# EAGLE board HDMI-Display_v10-0603 (EAGLE 7.2.0)
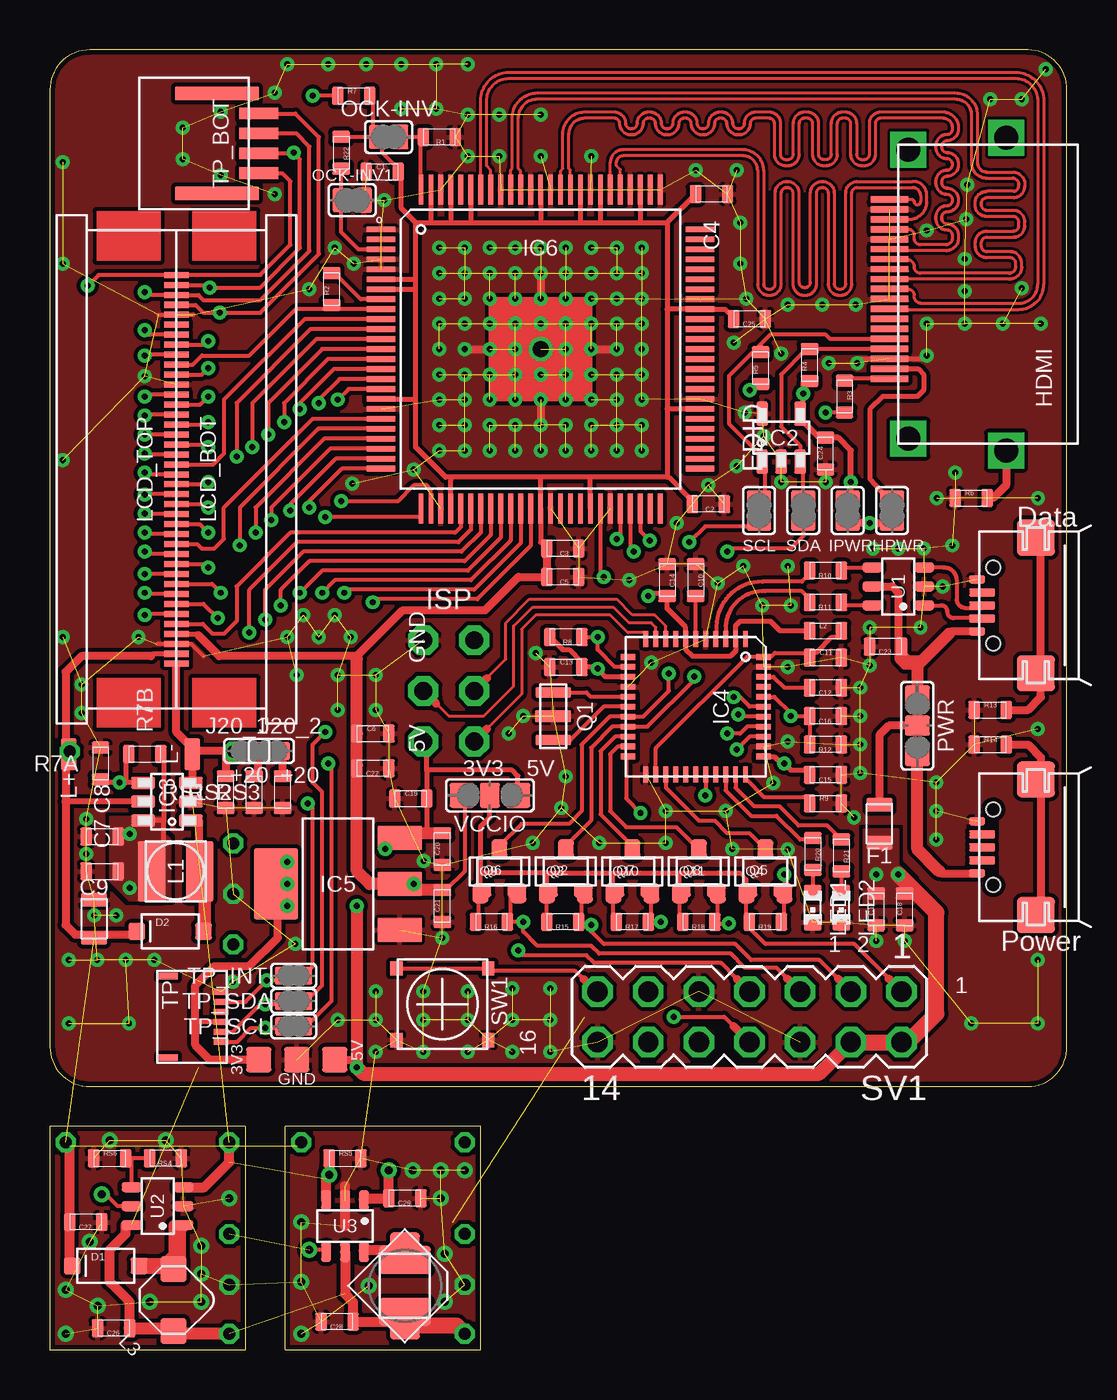
[diagram p2: board, top side]
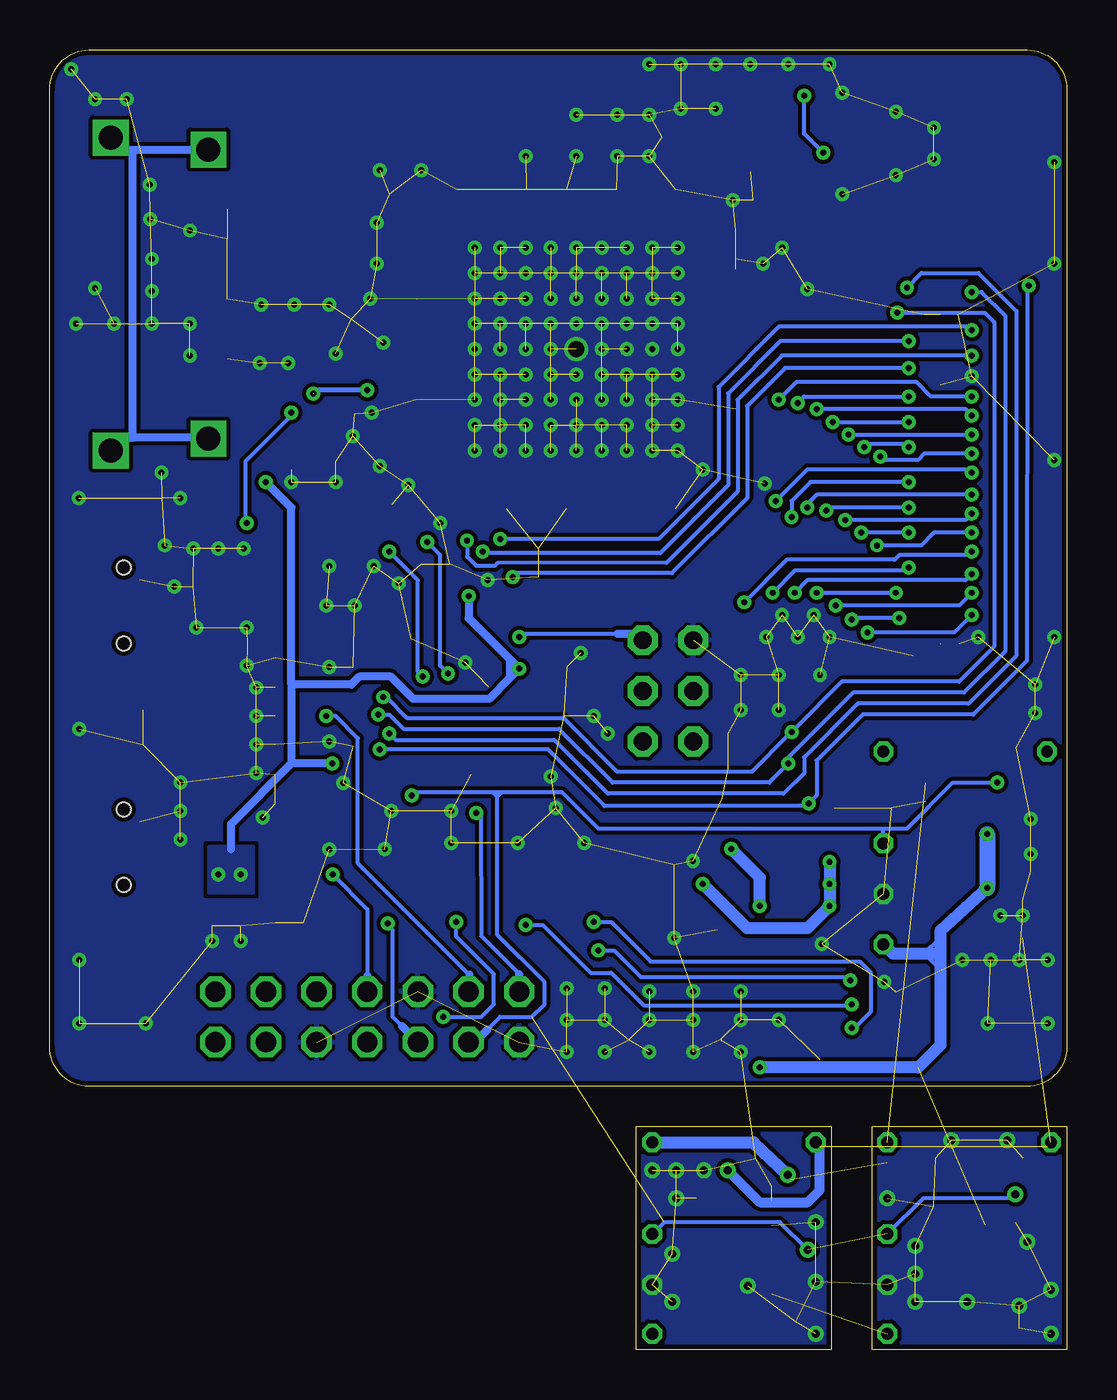
[diagram p3: board, bottom side, seen from below]

Size 51 x 65.2 mm. Coordinates in mm from the lower left corner, seen from the top.
Outline: 2,13.2 49.05,13.2 arc90 51,15.2 51,63.2 arc90 49.05,65.2 2,65.2 arc90 0,63.2 0,15.2 arc90 2,13.2
Outline: 0,0 9.8,0 9.8,11.2 0,11.2 0,0
Outline: 11.8,0 21.6,0 21.6,11.2 11.8,11.2 11.8,0
Copper layers (1+16): Top 0.018mm / dielectric 0.8mm / Bottom 0.018mm
Design rules "Rezonit-020-015": minimum track width 0.15mm, minimum drill 0.3mm, track to track 0.15mm, track to pad 0.2mm, pad to pad 0.2mm, via to via 0.2mm, smd to smd 0mil, copper to edge 0.25mm, drill to drill 0.3mm, minimum pad ring 0.2mm, minimum via ring 0.2mm, stop-mask expansion 4mil, vias tented up to drill 0.4mm, thermal gap 0.15mm

## Footprints (pad centres in the part's own frame; a part is rotated, then mirrored left to right if it is on the bottom)
PAD-1.27X1.27_NC = smd 1.27 x 1.27: 1 0,0
0603 = smd 0.6 x 0.9: 1 -0.8,0; 2 0.8,0
0805 = smd 0.7 x 1.3: 1 -0.95,0; 2 0.95,0
SOD-123 = smd 0.85 x 0.85: A 1.675,0; C -1.675,0
HDMI_10029449 = smd 1.9 x 0.3: 1 -0.95,4.75; 2 -0.95,4.25; 3 -0.95,3.75; 4 -0.95,3.25; 5 -0.95,2.75; 6 -0.95,2.25; 7 -0.95,1.75; 8 -0.95,1.25; 9 -0.95,0.75; 10 -0.95,0.25; 11 -0.95,-0.25; 12 -0.95,-0.75; 13 -0.95,-1.25; 14 -0.95,-1.75; 15 -0.95,-2.25; 16 -0.95,-2.75; 17 -0.95,-3.25; 18 -0.95,-3.75; 19 -0.95,-4.25 | drill 1.2 square: SHLD1 0,-7.25; SHLD2 4.9,-7.85; SHLD3 4.9,7.85; SHLD4 0,7.25
JUMPER2-0603 = smd 1.25 x 0.8: 1 0,0.6; 2 0,-0.6
SOT23-5 = smd 1.2 x 0.6: 1 -1.2,0.95; 2 -1.2,0; 3 -1.2,-0.95; 4 1.2,-0.95; 5 1.2,0.95
SOT23-6 = smd 1.2 x 0.6: 1 -1.2,0.95; 2 -1.2,0; 3 -1.2,-0.95; 4 1.2,-0.95; 5 1.2,0; 6 1.2,0.95
QFN44 = smd 0.8 x 0.3: 1 -3.4,2.5; 2 -3.4,2; 3 -3.4,1.5; 4 -3.4,1; 5 -3.4,0.5; 6 -3.4,0; 7 -3.4,-0.5; 8 -3.4,-1; 9 -3.4,-1.5; 10 -3.4,-2; 11 -3.4,-2.5; 23 3.4,-2.5; 24 3.4,-2; 25 3.4,-1.5; 26 3.4,-1; 27 3.4,-0.5; 28 3.4,0; 29 3.4,0.5; 30 3.4,1; 31 3.4,1.5; 32 3.4,2; 33 3.4,2.5 | smd 0.3 x 0.8: 12 -2.5,-3.4; 13 -2,-3.4; 14 -1.5,-3.4; 15 -1,-3.4; 16 -0.5,-3.4; 17 0,-3.4; 18 0.5,-3.4; 19 1,-3.4; 20 1.5,-3.4; 21 2,-3.4; 22 2.5,-3.4; 34 2.5,3.4; 35 2,3.4; 36 1.5,3.4; 37 1,3.4; 38 0.5,3.4; 39 0,3.4; 40 -0.5,3.4; 41 -1,3.4; 42 -1.5,3.4; 43 -2,3.4; 44 -2.5,3.4
SOT223 = smd 2.235 x 1.219: 1 -3.099,2.311; 2 -3.099,0; 3 -3.099,-2.311 | smd 2.2 x 3.6: 4 3.099,0
TQFP100-PAD = smd 1.5 x 0.3: 1 -8,6; 2 -8,5.5; 3 -8,5; 4 -8,4.5; 5 -8,4; 6 -8,3.5; 7 -8,3; 8 -8,2.5; 9 -8,2; 10 -8,1.5; 11 -8,1; 12 -8,0.5; 13 -8,0; 14 -8,-0.5; 15 -8,-1; 16 -8,-1.5; 17 -8,-2; 18 -8,-2.5; 19 -8,-3; 20 -8,-3.5; 21 -8,-4; 22 -8,-4.5; 23 -8,-5; 24 -8,-5.5; 25 -8,-6; 51 8,-6; 52 8,-5.5; 53 8,-5; 54 8,-4.5; 55 8,-4; 56 8,-3.5; 57 8,-3; 58 8,-2.5; 59 8,-2; 60 8,-1.5; 61 8,-1; 62 8,-0.5; 63 8,0; 64 8,0.5; 65 8,1; 66 8,1.5; 67 8,2; 68 8,2.5; 69 8,3; 70 8,3.5; 71 8,4; 72 8,4.5; 73 8,5; 74 8,5.5; 75 8,6 | smd 0.3 x 1.5: 26 -6,-8; 27 -5.5,-8; 28 -5,-8; 29 -4.5,-8; 30 -4,-8; 31 -3.5,-8; 32 -3,-8; 33 -2.5,-8; 34 -2,-8; 35 -1.5,-8; 36 -1,-8; 37 -0.5,-8; 38 0,-8; 39 0.5,-8; 40 1,-8; 41 1.5,-8; 42 2,-8; 43 2.5,-8; 44 3,-8; 45 3.5,-8; 46 4,-8; 47 4.5,-8; 48 5,-8; 49 5.5,-8; 50 6,-8; 76 6,8; 77 5.5,8; 78 5,8; 79 4.5,8; 80 4,8; 81 3.5,8; 82 3,8; 83 2.5,8; 84 2,8; 85 1.5,8; 86 1,8; 87 0.5,8; 88 0,8; 89 -0.5,8; 90 -1,8; 91 -1.5,8; 92 -2,8; 93 -2.5,8; 94 -3,8; 95 -3.5,8; 96 -4,8; 97 -4.5,8; 98 -5,8; 99 -5.5,8; 100 -6,8
ISP = drill 0.9 pad 1.5 octagon: GND 1.27,-2.54; MISO -1.27,2.54; MOSI 1.27,0; RST -1.27,-2.54; SCK -1.27,0; VCC 1.27,2.54
JUMPER2-0402 = smd 0.9 x 0.8: 1 0,0.55; 2 0,-0.55
L_1212 = smd 3 x 1.4: 1 0,1.2; 2 0,-1.2
CDRH2D18 = smd 1.3 x 1.3 rotated 45: 1 -1.1,1.1; 2 1.1,-1.1
CDRH3D16 = smd 1.5 x 1.4 rotated 45: 1 -1.4,1.4; 2 1.4,-1.4
LQH32CN_23/LQH32CN_33 = smd 1.4 x 2.6: 1 -1.3,0; 2 1.3,0
PAD-0.80X1.60_NC = smd 0.8 x 1.6: 1 0,0
FPC40 = smd 1.27 x 0.279: 1 0,9.75; 2 0,9.25; 3 0,8.75; 4 0,8.25; 5 0,7.75; 6 0,7.25; 7 0,6.75; 8 0,6.25; 9 0,5.75; 10 0,5.25; 11 0,4.75; 12 0,4.25; 13 0,3.75; 14 0,3.25; 15 0,2.75; 16 0,2.25; 17 0,1.75; 18 0,1.25; 19 0,0.75; 20 0,0.25; 21 0,-0.25; 22 0,-0.75; 23 0,-1.25; 24 0,-1.75; 25 0,-2.25; 26 0,-2.75; 27 0,-3.25; 28 0,-3.75; 29 0,-4.25; 30 0,-4.75; 31 0,-5.25; 32 0,-5.75; 33 0,-6.25; 34 0,-6.75; 35 0,-7.25; 36 0,-7.75; 37 0,-8.25; 38 0,-8.75; 39 0,-9.25; 40 0,-9.75
FPC40' = smd 1.27 x 0.279: 1 0.003,9.75; 2 0.003,9.25; 3 0.003,8.75; 4 0.003,8.25; 5 0.003,7.75; 6 0.003,7.25; 7 0.003,6.75; 8 0.003,6.25; 9 0.003,5.75; 10 0.003,5.25; 11 0.003,4.75; 12 0.003,4.25; 13 0.003,3.75; 14 0.003,3.25; 15 0.003,2.75; 16 0.003,2.25; 17 0.003,1.75; 18 0.003,1.25; 19 0.003,0.75; 20 0.003,0.25; 21 0.003,-0.25; 22 0.003,-0.75; 23 0.003,-1.25; 24 0.003,-1.75; 25 0.003,-2.25; 26 0.003,-2.75; 27 0.003,-3.25; 28 0.003,-3.75; 29 0.003,-4.25; 30 0.003,-4.75; 31 0.003,-5.25; 32 0.003,-5.75; 33 0.003,-6.25; 34 0.003,-6.75; 35 0.003,-7.25; 36 0.003,-7.75; 37 0.003,-8.25; 38 0.003,-8.75; 39 0.003,-9.25; 40 0.003,-9.75
LED_0603 = smd 0.9 x 0.8: A 0,-0.75; C 0,0.75
JUMPER2-0603_NC = smd 1.25 x 0.8: 1 0,0.6 | smd 1.2 x 0.8: 2 0,-0.6
JUMPER3-0603 = smd 1.25 x 1.25: 1 0,1.4; 3 0,-1.4 | smd 1.25 x 1: 2 0,0
CRYSTAL_32X13 = smd 1.8 x 0.5: 1 0,1.2; 2 0,-1.2 | smd 1.8 x 0.6: GND 0,0
SOT323 = smd 0.5 x 0.7: 1 -0.65,-0.95; 2 0.65,-0.95; 3 0,0.95
SOT-23 = smd 0.8 x 1: 1 -0.95,-1.1; 2 0.95,-1.1; 3 0,1.1
MA07-2 = drill 1.016 octagon: 1 -7.62,-1.27; 2 -7.62,1.27; 3 -5.08,-1.27; 4 -5.08,1.27; 5 -2.54,-1.27; 6 -2.54,1.27; 7 0,-1.27; 8 0,1.27; 9 2.54,-1.27; 10 2.54,1.27; 11 5.08,-1.27; 12 5.08,1.27; 13 7.62,-1.27; 14 7.62,1.27
SW_TL3315N = smd 0.65 x 0.7: 1 -2.3,1.8; 2 -2.3,-1.8; 3 2.3,-1.8; 4 2.3,1.8
FPC06 = smd 0.75 x 0.28: 1 0,1.25; 2 0,0.75; 3 0,0.25; 4 0,-0.25; 5 0,-0.75; 6 0,-1.25 | smd 1 x 0.3: SHLD1 2.65,2.04; SHLD2 2.65,-2.04
FPC04 = smd 2 x 0.6: 1 0,1.5; 2 0,0.5; 3 0,-0.5; 4 0,-1.5 | smd 4.2 x 0.7: SHLD1 2.1,2.5; SHLD2 2.1,-2.5
SOT23-6' = smd 1 x 0.5: 1 -1.3,0.95; 2 -1.3,0; 3 -1.3,-0.95; 4 1.3,-0.95; 5 1.3,0; 6 1.3,0.95
JUMPER3-0603_NC = smd 1.25 x 1.25: 1 0,1.4; 3 0,-1.4 | smd 1.25 x 1: 2 0,0
CU09SAM = smd 0.4 x 0.8: 1 1.3,-5.1; 5 -1.3,-5.1 | smd 0.4 x 1.3: 2 0.65,-4.85; 3 0,-4.85; 4 -0.65,-4.85 | smd 1.8 x 1.9: GND@1 -3.4,-2.15; GND@4 3.4,-2.15 | smd 1 x 1: GND@2 -3.2,-2.2; GND@3 3.2,-2.2 | hole 0.7: -1.9,-4.3; 1.9,-4.3

## Placement (x,y rotation side)
3V3  PAD-1.27X1.27_NC  [PAD-1.27X1.27_NC]  10.48,14.55 180 top
5V  PAD-1.27X1.27_NC  [PAD-1.27X1.27_NC]  14.29,14.55 180 top
C1  100n  [0603]  16.67,59.08 0 top
C2  100n  [0603]  33.02,42.41 180 top
C3  100n  [0603]  25.72,40.19 180 top
C4  100n  [0603]  33.18,57.97 180 top
C5  4u7  [0603]  25.72,38.76 180 top
C6  4u7  [0603]  16.2,30.9 0 top
C7  4u7  [0603]  2.62,23.99 0 top
C8  100n  [0603]  2.62,25.74 0 top
C9  1u @ 40V  [0805]  2.22,21.61 270 top
C10  1u  [0603]  32.38,38.6 270 top
C11  100n  [0603]  38.89,34.71 0 top
C12  100n  [0603]  38.89,33.2 180 top
C13  100n  [0603]  25.88,34.23 0 top
C14  100n  [0603]  30.96,38.6 270 top
C15  100n  [0603]  38.89,28.83 180 top
C16  tbd  [0603]  38.89,31.77 180 top
C17  100n  [0603]  41.43,22.09 90 top
C18  4u7  [0603]  42.86,22.09 90 top
C19  4u7  [0603]  18.1,27.65 0 top
C20  100n  [0603]  19.68,25.11 90 top
C21  100n  [0603]  19.68,22.25 90 top
C22  100n  [0603]  16.2,29.15 180 top
C23  100n  [0603]  41.91,35.27 180 top
C24  100n  [0603]  38.89,44.95 90 top
C25  100n  [0603]  35.08,51.7 180 top
C26  4u7  [0603]  3.2,1.08 180 top
C27  1u  [0603]  1.8,6.4 180 top
C28  4u7  [0603]  14.4,1.4 180 top
C29  1u  [0603]  17.8,7.6 180 top
D1  MBR120LSFT1G  [SOD-123]  2.8,4.2 0 top
D2  MBR120LSFT1G  [SOD-123]  6.03,20.98 0 top
F1  0.6A  [0805]  41.59,26.38 90 top
GND  PAD-1.27X1.27_NC  [PAD-1.27X1.27_NC]  12.38,14.55 180 top
HDMI  HDMI-A  [HDMI_10029449]  43.05,52.95 0 top
HPWR  JUMPER2-0603  [JUMPER2-0603]  42.23,42.09 0 top
IC2  24LC02B  [SOT23-5]  36.67,45.74 90 top
IC3  IS31BL3506A-TTLS2  [SOT23-6]  5.87,27.49 180 top
IC4  ATMEGA32U4-MU  [QFN44]  32.38,32.25 270 top
IC5  LDO-TS1117CW-3V3  [SOT223]  14.45,23.36 180 top
IC6  TFP401A-PAD  [TQFP100-PAD]  24.61,50.19 0 top
IPWR  JUMPER2-0603  [JUMPER2-0603]  40.01,42.09 180 top
ISP  ISP  [ISP]  20,33.04 180 top
J20_1  JUMPER2-0402  [JUMPER2-0402]  9.87,30.03 90 top
J20_2  JUMPER2-0402  [JUMPER2-0402]  11.11,30.03 90 top
L1  10u @ 500mA  [L_1212]  6.31,23.99 90 top
L2  FB600  [0603]  38.89,36.06 0 top
L3  CDRH2D18/LDNP-4R7NC  [CDRH2D18]  6.2,2.48 135 top
L4  CDRH3D16NP-220NC  [CDRH3D16]  17.8,3.2 315 top
L5  LQH32CN220K23  [LQH32CN_23/LQH32CN_33]  17.8,3.2 90 top
L+  PAD-0.80X1.60_NC  [PAD-0.80X1.60_NC]  0.95,29.87 0 top
L-  PAD-0.80X1.60_NC  [PAD-0.80X1.60_NC]  7.14,29.87 0 top
LCD_BOT  FPC40  [FPC40]  6.35,44.16 0 top
LCD_TOP  ER-TFT050-3  [FPC40']  6.35,44.16 180 top
LED1  green  [LED_0603]  38.26,22.17 180 top
LED2  red  [LED_0603]  39.69,22.17 180 top
OCK-INV  JUMPER2-0603-NC  [JUMPER2-0603_NC]  16.99,60.83 270 top
OCK-INV1  JUMPER2-0603-NC  [JUMPER2-0603_NC]  15.16,57.66 270 top
PWR  JUMPER3-0603  [JUMPER3-0603]  43.5,31.3 180 top
Q1  16MHz  [CRYSTAL_32X13]  25.24,31.77 0 top
Q2  [SOT323]  25.88,23.99 0 top
Q3  BSS138  [SOT-23]  25.88,23.99 0 top
Q4  BSS138  [SOT-23]  35.88,23.99 0 top
Q5  [SOT323]  35.88,23.99 0 top
Q6  [SOT323]  22.54,23.99 0 top
Q7  [SOT323]  29.21,23.99 0 top
Q8  [SOT323]  32.54,23.99 0 top
Q9  BSS138  [SOT-23]  22.54,23.99 0 top
Q10  BSS138  [SOT-23]  29.21,23.99 0 top
Q11  BSS138  [SOT-23]  32.54,23.99 0 top
R1  10K  [0603]  19.53,60.83 180 top
R2  1K  [0603]  14.13,53.2 90 top
R3  10K  [0603]  39.85,47.81 270 top
R4  4K7  [0603]  38.1,49.39 90 top
R5  4K7  [0603]  35.64,49.24 90 top
R6  0  [0603]  46.2,42.73 0 top
R7  NM  [0603]  15.24,62.89 0 top
R7A  100k  [0603]  2.54,29.4 270 top
R7B  NM  [0603]  4.76,29.87 0 top
R8  10k  [0603]  25.88,35.74 180 top
R9  10k  [0603]  38.89,27.4 0 top
R10  22  [0603]  38.89,39.08 180 top
R11  22  [0603]  38.89,37.49 180 top
R12  tbd  [0603]  38.89,30.34 180 top
R13  0  [0603]  47.15,32.09 0 top
R14  0  [0603]  47.15,30.34 0 top
R15  4k7  [0603]  25.72,21.45 180 top
R16  4k7  [0603]  22.15,21.45 180 top
R17  4k7  [0603]  29.21,21.45 180 top
R18  4k7  [0603]  32.54,21.45 180 top
R19  4k7  [0603]  35.88,21.45 180 top
R20  4k7  [0603]  38.26,24.86 270 top
R21  4k7  [0603]  39.69,24.78 270 top
R22  10K  [0603]  14.61,60.03 270 top
RS1  15  [0603]  8.81,27.96 90 top
RS2  15  [0603]  10.24,27.96 90 top
RS3  15  [0603]  11.67,27.96 90 top
RS4  1K5  [0603]  5.8,9.6 180 top
RS5  10  [0603]  14.8,9.6 0 top
RS6  DNP  [0603]  3,9.6 0 top
SCL  JUMPER2-0603  [JUMPER2-0603]  35.56,42.09 0 top
SDA  JUMPER2-0603  [JUMPER2-0603]  37.78,42.09 0 top
SV1  [MA07-2]  35.08,16.69 180 top
SW1  SW-TACTILE-TL3315  [SW_TL3315N]  19.68,17.33 0 top
TP  FPC06  [FPC06]  8.57,16.69 180 top
TP_BOT  FPC04  [FPC04]  10.48,60.51 180 top
TP_INT  JUMPER2-0402  [JUMPER2-0402]  12.22,18.76 270 top
TP_SCL  JUMPER2-0402  [JUMPER2-0402]  12.22,16.22 270 top
TP_SDA  JUMPER2-0402  [JUMPER2-0402]  12.22,17.49 270 top
U1  USBLC6-2SC6  [SOT23-6']  42.55,38.28 180 top
U2  LT1932  [SOT23-6']  5.4,7.2 180 top
U3  LT3465  [SOT23-6']  14.8,6.2 270 top
VCCIO  JUMPER3-0603-NC  [JUMPER3-0603_NC]  22.07,27.8 270 top
X5  USB-CU09SAM  [CU09SAM]  51.59,37.33 270 top
X6  USB-CU09SAM  [CU09SAM]  51.59,25.2 270 top

## Tracks (layer width: path | path; a pad name or v marks a point on that pad's centre or on a via)
+3V3  (via drill 0.3)
  Top 0.203: 19.11,56.59 19.05,56.54 | 21.11,56.55 21.11,56.54 | 29.61,56.62 29.53,56.54 | 27.61,56.63 27.61,56.54 | 26.61,56.6 26.67,56.54 | 31.02,52.19 30.96,52.19 | 31.05,47.19 30.96,47.19 | 27.11,43.72 27.15,43.76 | 20.11,43.62 20.16,43.76 | 18.33,53.69 18.34,53.68 | 18.32,53.19 18.34,53.29 | 18.3,47.69 18.34,47.65 | 20.11,56.59 20.16,56.54 | VCCIO.3 20.67,27.93 20.8,27.8 20.8,23.99 19.86,23.06 | C1.2 17.47,59.23 16.67,60.03 16.67,60.54 OCK-INV.2 | R22.1 OCK-INV.2 | R7.2 16.19,62.89 16.19,61.02 OCK-INV.2
  Top 0.254: 18.34,56.54 18.34,53.68 18.34,53.29 18.34,47.65 18.34,45.27 19.84,43.76 20.16,43.76 24.61,43.76 | 18.34,56.54 19.05,56.54 20.16,56.54 21.11,56.54 24.61,56.54 | 24.61,56.54 26.67,56.54 27.61,56.54 29.53,56.54 30.96,56.54 | 30.96,56.54 30.96,52.19 30.96,47.19 30.96,43.76 | 30.96,43.76 27.15,43.76 24.61,43.76 | IC6.99 19.11,56.59 | IC6.95 21.11,56.55 | IC6.78 29.61,56.62 | IC6.82 27.61,56.63 | IC6.84 26.61,56.6 | IC6.88 24.61,56.54 | 31.02,52.19 IC6.67 33.88,52.19 34.28,51.78 C25.2 | IC6.57 31.05,47.19 | IC6.43 27.11,43.72 | 24.61,43.76 IC6.38 24.61,40.5 C3.2 24.92,40.03 | IC6.29 20.11,43.62 | IC6.6 18.33,53.69 | IC6.7 18.32,53.19 | IC6.18 18.3,47.69 | IC6.97 20.11,56.59 | LCD_BOT.37 7.38,35.91 7.46,35.82 | 30.96,56.54 30.96,56.55 C4.2 | 30.96,43.76 31.03,43.76 32.22,42.58 C2.2 | 24.92,38.93 C5.2 | TP.3 7.39,16.44 7.3,16.53 | 11.27,23.28 IC5.4 v11.91,23.36 | 11.43,22.25 v11.91,22.25 | 18.34,56.54 17.62,57.26 17.62,59.08 C1.2 | C21.2 19.69,23.06 19.86,23.06 | C22.2 15.24,29.16 15.4,29.31 | C6.1
  Top 0.406: 7.46,35.82 8.49,34.79 15.24,34.79 | C5.2 23.5,38.76 21.83,37.09 17.7,37.09 15.4,34.79 15.24,34.79 | 24.92,38.93 C3.2 | 15.4,34.63 15.24,34.79 | 11.43,22.25 11.43,20.66 10.01,19.24 8.26,19.24 7.3,18.28 7.3,16.53 7.3,15.26 8.02,14.55 3V3.1
  Top 0.61: C21.2 17.55,23.05 IC5.2 | v18.26,23.36 IC5.2 | IC5.2 16.03,23.36 15.4,23.99 15.4,29.31 C6.1 15.4,34.63 | v11.91,24.47 v11.91,23.36 v11.91,22.25
  Bottom 0.61: v11.91,24.47 v11.91,22.25 13.02,21.14 16.03,21.14 v18.26,23.36
+5V  (via drill 0.3, 0.6)  (3 unrouted)
  Top 0.203: IC5.3 | 37.78,48.59 R4.1 | 5.58,29.61 5.56,29.62 R7B.2
  Top 0.254: 5.58,29.61 5.71,29.61 5.71,26.54 | 5.71,25.42 5.71,26.54 | 5.71,26.54 IC3.6 | IC4.34 36.31,29.75 36.67,29.39 v36.83,29.39 37.15,29.07 38.09,29.07 C15.2 | L2.1 36.6,36.06 36.12,36.54 34.61,36.54 34.38,36.31 IC4.2 34.38,35.04 34.13,34.79 32.23,34.79 31.89,35.13 IC4.7 31.89,36.24 30.96,37.17 C14.2 | C14.2 | VCCIO.1 23.47,28.79 23.18,29.07 18.89,29.07 | 18.89,29.07 18.89,30.34 ISP.VCC | IC4.14 27.87,33.75 v27.46,34.16 27.38,34.23 C13.2 26.68,34.47 26.04,35.11 25.72,35.11 R8.2 | v30,37.81 30.16,37.97 30.96,37.97 C14.2 | IC2.4 37.62,47.01 37.78,47.01 37.78,47.65 v37.78,47.97 37.78,48.59 | 18.89,29.07 C19.2 18.9,25.9 | C20.2 | R5.1 35.4,48.44 v35.08,48.12 | 38.91,45.74 C24.2
  Top 0.305: 38.91,45.74 39.53,45.74 40.16,45.11 v40.16,43.52 40.16,42.85 IPWR.2 | 37.62,47.01 37.62,46.7 38.57,45.75 C24.2
  Top 0.406: 5V.1 15.4,14.55
  Top 0.5: C26.1 4,2.4 3,3.4 3,5 3.8,5.8 3.8,6.25 U2.6 | U3.5 14.8,2.8 15.2,2.4 C28.1 17.8,1.4 | 17.8,1.4 L5.1 | 17.8,1.4 L4.2
  Top 0.6: v9,0.8 6.2,0.8 L3.1 6.2,1.08 C26.1
  Top 0.61: IC5.3 17.78,25.9 18.9,25.9 C20.2 19.79,25.9 | v15.4,22.25 15.4,14.55 v15.4,14.15 | SV1.4 | v16.83,25.11 17.3,25.58 17.46,25.58 IC5.3
  Top 0.7: v15.4,14.15 15.72,13.83 38.58,13.83 SV1.4
  Top 0.8: L4.2 20.38,1.22 v20.8,0.8
  Top 0.813: SV1.4 SV1.2 43.02,15.42 44.45,16.85 44.45,21.93 v42.55,23.84
  Bottom 0.203: 6.35,19.07 7.14,19.87 6.35,20.66
  Bottom 0.254: v35.08,48.12 37.54,48.12 37.7,47.97 v37.78,47.97
  Bottom 0.406: 38.89,33.36 35.88,33.36 35.48,33.76 33.9,33.76 32.78,32.65 28.97,32.65 27.94,33.68 | 38.89,33.36 38.89,29.39 | v36.83,29.39 38.89,29.39 | 27.94,33.68 v27.46,34.16 27.94,34.63 | 41.91,25.11 41.91,26.38 38.89,29.39 | v30,37.81 30,36.7 27.94,34.63 | 38.89,33.36 38.89,42.25 v40.16,43.52 | 27.94,34.63 27.94,33.68
  Bottom 0.61: v15.4,22.25 15.4,23.68 v16.83,25.11 | v4.01,23.16 6.35,21.02 6.35,20.66 6.35,19.87 | 6.35,19.87 6.35,19.07 6.35,15.26 7.46,14.15 v15.4,14.15 | v9.2,20.32 9.18,20.32 8.73,19.87 7.14,19.87 6.35,19.87
  Bottom 0.813: v4.01,25.86 v4.01,23.16
  other vias: 41.43,23.84
  pour Top (no thermals): 3.02,26.69 3.02,23.52 3.97,22.57 6.03,22.57 6.03,25.58 5.71,25.9 5.71,26.69
  pour Top (no thermals): 40.8,26.06 40.8,22.41 43.34,22.41 43.34,23.52 42.55,24.31 42.55,26.06
  pour Bottom: 40.8,22.88 43.02,22.88 43.02,25.27 40.8,25.27
AREF
  Top 0.203: IC4.42 36.28,33.75 36.83,33.2 C12.2
AVCC
  Top 0.203: IC4.24 30.39,30.17 34.96,34.75 IC4.44 36.16,34.75 36.35,34.95 38.1,34.95 | 38.1,34.95 38.16,34.95 | C11.1 38.1,34.64 38.1,34.95
  Top 0.254: 38.16,34.95 38.18,34.95 38.22,34.99 38.47,34.99 39.21,35.74 39.69,35.74 L2.2
B0
  Top 0.203: IC6.10 12.77,51.69 8.73,47.65 8.73,44.95 8.19,44.41 LCD_BOT.20
B1  (via drill 0.3)
  Top 0.203: IC6.11 13.06,51.19 9.37,47.49 v9.37,44.79 | v4.76,44.95 4.81,44.91 LCD_BOT.19
  Bottom 0.203: v4.76,44.95 7.14,44.95 7.46,44.63 9.21,44.63 v9.37,44.79
B2  (via drill 0.3)
  Top 0.203: IC6.12 13.36,50.69 10.16,47.49 v10.16,45.27 | v7.94,45.27 7.8,45.41 LCD_BOT.18
  Bottom 0.203: v7.94,45.27 8.1,45.43 10,45.43 v10.16,45.27
B3  (via drill 0.3)
  Top 0.203: IC6.13 13.65,50.19 10.95,47.49 v10.95,45.9 | v4.76,45.9 v4.77,45.91 LCD_BOT.17
  Bottom 0.203: v10.95,45.9 v4.76,45.9
B4  (via drill 0.3)
  Top 0.203: IC6.14 13.95,49.69 11.75,47.49 v11.75,46.54 | v7.94,46.54 7.81,46.41 LCD_BOT.16
  Bottom 0.203: v11.75,46.54 v7.94,46.54
B5  (via drill 0.3)
  Top 0.203: IC6.15 14.24,49.19 12.54,47.49 v12.54,47.17 | v4.76,46.86 4.81,46.91 LCD_BOT.15
  Bottom 0.203: v4.76,46.86 5.08,47.17 v12.54,47.17
B6  (via drill 0.3)
  Top 0.203: IC6.16 14.53,48.69 13.49,47.65 v13.49,47.49 | v7.94,47.81 7.54,47.41 LCD_BOT.14
  Bottom 0.203: v13.49,47.49 13.18,47.81 v7.94,47.81
B7  (via drill 0.3)
  Top 0.203: IC6.17 14.99,48.19 v14.45,47.65 | v4.76,47.81 4.86,47.91 LCD_BOT.13
  Bottom 0.203: v4.76,47.81 6.83,47.81 7.54,48.53 13.57,48.53 v14.45,47.65
CLK  (via drill 0.3)
  Top 0.203: v7.94,49.24 7.61,48.91 LCD_BOT.11 | IC6.44 27.61,38.93 v27.78,38.76
  Bottom 0.203: v7.94,49.24 14.13,49.24 16.04,47.33 16.04,42.73 19.81,38.96 27.58,38.96 v27.78,38.76 27.77,38.76
CLK_N
  Top 0.152: IC6.94 21.61,58.92 21.6,58.93 21.6,62.65 arc-90 23.02,64.07 48.42,64.07 arc-90 49.84,62.65 49.84,53.44 arc-90 48.58,52.18 42.16,52.18 HDMI.12
CLK_P
  Top 0.152: IC6.93 22.11,59.17 21.9,59.38 21.9,62.65 arc-90 23.02,63.77 48.42,63.77 arc-90 49.54,62.65 49.54,53.44 arc-90 48.58,52.48 43.66,52.48 arc-90 43.34,52.89 arc90 43.03,53.2 HDMI.10
D0_N
  Top 0.152: IC6.91 23.11,59.17 23.18,59.24 23.18,61.78 arc-90 24.45,63.04 45.4,63.04 arc-90 46.51,61.94 46.51,59.55 arc90 46.99,59.07 48.34,59.07 arc-90 48.89,58.36 arc-90 48.32,57.79 46.97,57.79 arc90 46.7,57.45 46.7,57.49 arc90 46.97,57.14 48.32,57.14 arc-90 48.89,56.57 48.89,56.38 arc-90 48.32,55.8 46.98,55.8 arc90 46.71,55.54 46.71,55.34 arc90 46.98,55.07 48.16,55.07 arc-90 48.73,54.5 48.73,54.32 arc-90 48.1,53.69 42.86,53.69 42.84,53.7 HDMI.9
D0_P
  Top 0.152: IC6.90 23.61,59.13 23.49,59.24 23.49,61.78 arc-90 24.45,62.74 45.4,62.74 arc-90 46.2,61.94 46.2,59.55 arc90 46.99,58.77 48.26,58.77 arc-90 48.58,58.44 arc-90 48.32,58.1 46.98,58.1 arc90 46.39,57.53 46.39,57.41 arc90 46.98,56.84 48.32,56.84 arc-90 48.58,56.57 48.58,56.38 arc-90 48.32,56.11 46.98,56.11 arc90 46.41,55.54 46.41,55.34 arc90 46.98,54.77 48.16,54.77 arc-90 48.42,54.5 48.42,54.32 arc-90 48.1,53.99 43.66,53.99 arc-90 43.34,54.32 arc90 42.95,54.7 HDMI.7
D1_N
  Top 0.152: IC6.86 25.61,59.13 25.72,59.24 25.72,60.98 arc-90 26.83,62.09 28.29,62.09 arc-90 28.86,61.52 arc90 29.13,61.25 29.19,61.25 arc90 29.46,61.52 arc-90 30.03,62.09 30.09,62.09 arc-90 30.66,61.52 arc90 30.92,61.25 30.98,61.25 arc90 31.25,61.52 arc-90 31.82,62.09 31.88,62.09 arc-90 32.45,61.52 arc90 32.71,61.25 32.77,61.25 arc90 33.04,61.52 arc-90 33.61,62.09 33.67,62.09 arc-90 34.24,61.52 arc90 34.51,61.25 34.56,61.25 arc90 34.83,61.52 arc-90 35.4,62.09 36.06,62.09 arc-90 36.63,61.52 36.63,59.97 arc90 36.9,59.7 37.01,59.7 arc90 37.28,59.97 37.28,61.52 arc-90 37.85,62.09 37.97,62.09 arc-90 38.54,61.52 38.54,59.97 arc90 38.81,59.7 38.92,59.7 arc90 39.19,59.97 39.19,61.52 arc-90 39.76,62.09 39.88,62.09 arc-90 40.45,61.52 40.45,59.97 arc90 40.72,59.7 40.83,59.7 arc90 41.1,59.97 41.1,61.52 arc-90 41.67,62.09 44.77,62.09 arc-90 45.55,61.3 45.55,61.21 arc-90 44.98,60.64 arc90 44.72,60.38 44.72,60.32 arc90 44.98,60.05 arc-90 45.55,59.48 45.55,59.42 arc-90 44.98,58.85 arc90 44.72,58.59 44.72,58.53 arc90 44.98,58.26 arc-90 45.55,57.69 45.55,57.64 arc-90 44.98,57.06 arc90 44.72,56.8 44.72,56.74 arc90 44.98,56.47 arc-90 45.55,55.9 45.55,55.75 arc-90 44.93,55.12 42.18,55.12 HDMI.6
D1_P
  Top 0.152: IC6.85 26.11,59.17 26.03,59.24 26.03,60.98 arc-90 26.83,61.78 28.29,61.78 arc-90 28.56,61.52 arc90 29.13,60.95 29.19,60.95 arc90 29.76,61.52 arc-90 30.03,61.78 30.09,61.78 arc-90 30.35,61.52 arc90 30.92,60.95 30.98,60.95 arc90 31.55,61.52 arc-90 31.82,61.78 31.88,61.78 arc-90 32.14,61.52 arc90 32.71,60.95 32.77,60.95 arc90 33.34,61.52 arc-90 33.61,61.78 33.67,61.78 arc-90 33.93,61.52 arc90 34.51,60.95 34.56,60.95 arc90 35.13,61.52 arc-90 35.4,61.78 36.06,61.78 arc-90 36.32,61.52 36.32,59.97 arc90 36.9,59.4 37.01,59.4 arc90 37.58,59.97 37.58,61.52 arc-90 37.85,61.78 37.97,61.78 arc-90 38.23,61.52 38.23,59.97 arc90 38.81,59.4 38.92,59.4 arc90 39.49,59.97 39.49,61.52 arc-90 39.76,61.78 39.88,61.78 arc-90 40.15,61.52 40.15,59.97 arc90 40.72,59.4 40.83,59.4 arc90 41.41,59.97 41.41,61.52 arc-90 41.67,61.78 44.77,61.78 arc-90 45.25,61.3 45.25,61.21 arc-90 44.98,60.95 arc90 44.41,60.38 44.41,60.32 arc90 44.98,59.75 arc-90 45.25,59.48 45.25,59.42 arc-90 44.98,59.16 arc90 44.41,58.59 44.41,58.53 arc90 44.98,57.96 arc-90 45.25,57.69 45.25,57.64 arc-90 44.98,57.37 arc90 44.41,56.8 44.41,56.74 arc90 44.98,56.17 arc-90 45.25,55.9 45.25,55.75 arc-90 44.93,55.42 43.66,55.42 arc-90 43.34,55.75 43.34,55.9 arc90 43.04,56.2 HDMI.4
D2_N
  Top 0.152: 28.11,59.09 28.11,59.08 | 28.11,59.08 28.11,59.55 arc-90 28.73,60.18 34.77,60.18 arc-90 35.79,59.16 35.79,53.46 arc90 36.06,53.19 36.1,53.19 arc90 36.37,53.46 36.37,58.03 arc-90 36.94,58.6 36.99,58.6 arc-90 37.56,58.03 37.56,53.55 arc90 37.83,53.28 37.87,53.28 arc90 38.14,53.55 38.14,58.03 arc-90 38.71,58.6 38.76,58.6 arc-90 39.33,58.03 39.33,53.46 arc90 39.6,53.19 39.64,53.19 arc90 39.91,53.46 39.91,58.03 arc-90 40.48,58.6 43.26,58.6 arc-90 43.97,57.97 43.97,57.81 arc-90 43.97,57.8 43.97,57.58 arc-90 43.09,56.7 HDMI.3 | IC6.81 28.11,59.08
D2_P
  Top 0.152: IC6.80 28.61,59.19 28.41,59.39 28.41,59.55 arc-90 28.73,59.88 34.77,59.88 arc-90 35.49,59.16 35.49,53.46 arc90 36.06,52.89 36.1,52.89 arc90 36.68,53.46 36.68,58.03 arc-90 36.94,58.29 36.99,58.29 arc-90 37.26,58.03 37.26,53.46 arc90 37.83,52.89 37.87,52.89 arc90 38.45,53.46 38.45,58.03 arc-90 38.71,58.29 38.76,58.29 arc-90 39.02,58.03 39.02,53.46 arc90 39.6,52.89 39.64,52.89 arc90 40.22,53.46 40.22,58.03 arc-90 40.48,58.29 43.26,58.29 arc-90 43.66,57.89 43.66,57.59 arc-90 43.5,57.42 arc-90 43.34,57.58 arc90 43.22,57.7 HDMI.1
D_N
  Top 0.203: 38.1,37.65 37.7,38.04 35.87,38.04 arc90 33.89,36.3 IC4.3 | 38.09,37.64 R11.2
  Top 0.254: 38.1,37.65 38.09,37.64
D_P
  Top 0.203: R10.2 38.09,38.91 37.7,38.52 35.73,38.52 arc90 33.42,36.3 33.42,35.69 IC4.4
DDC_SCL
  Top 0.203: 35.64,50.43 34.05,48.84 34.05,46.46 35.72,44.79 35.72,44.7 IC2.1 35.88,44.54 35.88,42.73 35.56,42.73 SCL.1 | 35.64,50.43 R5.2 | HDMI.15 39.12,50.7 38.92,50.9 36.12,50.9 35.64,50.43
DDC_SDA
  Top 0.152: 37.62,44.86 IC2.3
  Top 0.203: 37.62,44.86 37.62,45.35 36.67,46.3 36.67,48.92 37.86,50.11 37.94,50.11 R4.2 38.17,50.19 38.18,50.2 HDMI.16 | SDA.1 37.78,44.7 IC2.3
DE  (via drill 0.3)
  Top 0.2: LCD_BOT.7 5,50.91 v4.76,51.14
  Top 0.203: IC6.46 28.61,40.85 v28.42,40.66 | LCD_BOT.7
  Bottom 0.2: 14.44,51.31 17.46,48.28 17.46,43.68 20.48,40.66 v28.42,40.66
  Bottom 0.203: v4.76,51.14 4.87,51.26 4.92,51.31 14.44,51.31
G0
  Top 0.203: IC6.20 13.18,46.7 8.73,42.25 8.73,40.66 8.26,40.19 7.62,40.19 7.4,40.41 LCD_BOT.28
G1  (via drill 0.3)
  Top 0.203: IC6.21 13.46,46.19 9.53,42.25 v9.53,40.35 | v4.76,40.98 4.84,40.91 LCD_BOT.27
  Bottom 0.203: v4.76,40.98 6.67,40.98 7.3,40.35 v9.53,40.35
G2  (via drill 0.3)
  Top 0.203: IC6.22 13.76,45.69 10.32,42.25 v10.32,40.98 | v7.94,40.98 7.51,41.41 LCD_BOT.26
  Bottom 0.203: v7.94,40.98 v10.32,40.98
G3  (via drill 0.3)
  Top 0.203: IC6.23 14.05,45.19 11.11,42.25 v11.11,41.62 | v4.76,41.93 4.79,41.91 LCD_BOT.25
  Bottom 0.203: v4.76,41.93 5.08,41.62 v11.11,41.62
G4  (via drill 0.3)
  Top 0.203: IC6.24 14.34,44.69 12.06,42.41 v12.06,42.09 | v7.94,42.25 7.78,42.41 LCD_BOT.24
  Bottom 0.203: v7.94,42.25 11.91,42.25 v12.06,42.09
G5  (via drill 0.3)
  Top 0.203: IC6.25 14.64,44.19 13.02,42.57 v13.02,42.25 | v4.76,42.89 4.78,42.91 LCD_BOT.23
  Bottom 0.203: v4.76,42.89 12.54,42.89 13.02,42.41 v13.02,42.25
G6  (via drill 0.3)
  Top 0.203: v7.94,43.52 7.82,43.41 LCD_BOT.22 | IC6.26 18.61,41.81 18.57,41.77 v13.81,41.77
  Bottom 0.203: v7.94,43.52 12.86,43.52 13.81,42.57 v13.81,41.77
G7  (via drill 0.3)
  Top 0.203: v4.76,44 4.85,43.91 LCD_BOT.21 | v14.61,42.57 17.46,42.57 18.26,43.36 18.89,43.36 19.11,43.15 IC6.27
  Bottom 0.203: v4.76,44 4.92,44.16 13.02,44.16 v14.61,42.57
GND  (via drill 0.3, 0.4, 0.6, 0.8)  (355 unrouted)
  Top 0.203: 7.7,34.79 7.08,35.41 LCD_BOT.38 | 6.33,35.41 5.39,35.41 | 5.45,51.92 7.18,51.92
  Top 0.254: v40.48,49.47 40.48,49.71 43.81,49.71 v43.97,49.87
  Top 0.406: v20.8,50.19 v28.42,50.19 | 24.61,54.08 v24.61,46.38
  Top 0.5: 14.8,6.2 14.8,8.2
  other vias: 24.61,50.19 23.34,50.19 25.88,50.19 27.15,50.19 28.42,51.46 27.15,51.46 25.88,51.46 24.61,51.46 23.34,51.46 22.07,51.46 20.8,51.46 22.07,50.19 20.8,52.73 20.8,54 22.07,54 23.34,54 24.61,54 19.53,54 19.53,52.73 19.53,51.46 19.53,50.19 29.69,50.19 29.69,51.46 28.42,52.73 29.69,52.73 25.88,52.73 27.15,52.73 24.61,52.73 23.34,52.73 22.07,52.73 20.8,55.27 22.07,55.27 23.34,55.27 24.61,55.27 19.53,55.27 25.88,54 27.15,54 28.42,54 29.69,54 25.88,55.27 27.15,55.27 28.42,55.27 29.69,55.27 25.88,46.38 27.15,46.38 28.42,46.38 29.69,46.38 20.8,47.65 20.8,48.92 22.07,48.92 23.34,48.92 24.61,48.92 19.53,48.92 19.53,47.65 28.42,47.65 29.69,47.65 25.88,47.65 27.15,47.65 24.61,47.65 23.34,47.65 22.07,47.65 25.88,48.92 27.15,48.92 28.42,48.92 29.69,48.92 20.8,45.11 20.8,46.38 22.07,46.38 23.34,46.38 19.53,46.38 19.53,45.11 28.42,45.11 29.69,45.11 25.88,45.11 27.15,45.11 24.61,45.11 23.34,45.11 22.07,45.11 18.26,44.16 15.16,43.44 2.22,21.77 1.83,24.87 1.59,31.93 4.45,35.74 19.68,20.66 27.15,59.87 24.61,59.87 22.54,59.87 34.45,59.16 32.38,59.16 43.97,51.46 40.4,52.41 20.95,61.94 20.95,64.48 45.88,51.46 47.78,51.46 49.69,51.46 38.73,52.41 36.99,52.41 34.92,52.73 34.61,54.47 34.61,56.54 49.93,64.24 45.24,40.35 43.81,40.19 44.45,27.01 44.45,25.58 30.16,34.47 36.99,30.5 41.27,40.19 41.12,36.22 35.72,37.33 33.5,38.44 36.99,39.31 37.15,37.33 34.77,39.31 43.66,36.22 42.55,40.19 36.99,34.23 49.53,31.14 49.53,19.55 49.55,42.73 34.21,25.11 41.12,34.31 24.37,34.95 0.64,59.55 0.64,54.47 0.64,35.74 16.76,57.66 11.27,63.05 15.08,35.74 34.45,44.31 44.47,42.73 0.95,19.55 0.64,44.63 30.88,27.01 29.05,38.6 48.74,62.73 47.15,62.73 22.54,61.94 24.61,61.94 20.95,59.87 4.76,48.84 45.88,54.71 48.74,53.24 15.24,54.47 46,58.44 45.96,56.7 20.95,14.95 12.38,33.84 16.35,33.84 18.75,24.52 25.64,27.17 36.28,28.43 31.43,41.46 14.45,33.84 45.4,44 39.05,49.47 16.35,32.09 14.45,32.09 13.49,35.74 11.91,35.74 12.7,36.85 14.29,36.85 23.73,31.77 25.87,28.76 1.59,33.36 12.3,20.34 14.45,16.53 11.27,57.97 44.76,38.28 44.45,28.44 40.64,28.92 40.64,30.34 40.64,31.77 40.64,33.2 25.08,16.53 23.18,16.53 46.2,16.38 49.53,16.38 0.95,16.38 3.97,16.38 35.8,45.83 36.99,25.1 40.32,26.69 41.43,20.5 42.86,20.5 30.88,25.42 27.54,25.42 24.21,25.42 33.89,27.01 23.02,30.9 45.88,53.1 43.97,56.14 2.38,19.55 3.81,19.55 5.24,19.55 3.33,21.77 1.83,26.61 13.02,53.2 34.85,47.01 36.67,49.95 33.02,43.36 19.37,62.25 17.62,62.25 17.62,64.48 19.37,64.48 15.88,64.48 13.97,64.48 11.91,64.48 8.57,62.09 6.67,61.3 8.57,58.92 6.67,59.71 9.2,22.86 25.08,18.11 23.18,18.11 23.18,14.95 25.08,14.95 16.35,16.53 20.95,16.53 18.73,16.53 18.73,14.95 16.35,14.95 18.73,17.96 16.35,17.96 20.95,17.96 36.67,43.52 34.29,50.51 14.29,55.27 20.8,3.26 9,3.26 12.6,6.4 19.6,7.6 19.6,9 20.8,9 16,3.2 12.6,0.8 12.6,3.4 18.2,9 0.8,3 0.8,0.8 2.4,2.2 5,2.4 7.6,2.4 7.6,5.2 7.6,3.8 19.8,4.8 19.8,2.4 9,7.6 5.8,10.5 3,10.5 2,5.4 9.17,18.45 38.9,43.52
  pour Bottom (isolate 0.2, rank 2): 0,13.2 51.05,13.2 51.05,65.2 0,65.2
  pour Top (isolate 0.2, rank 2): 0,13.2 51.02,13.2 51.02,51.83 43.34,51.83 43.34,57.78 40.61,57.78 40.61,52.33 34.92,52.33 34.92,59.18 20.55,59.18 20.55,65.21 0,65.2
  pour Top (isolate 0.15): 20.55,65.21 20.55,58.52 34.92,58.52 34.92,52.33 40.64,52.33 40.64,57.73 43.34,57.73 43.34,51.86 43.42,51.83 51.04,51.83 51.04,65.21
  pour Top (isolate 0.2): 12,11 21.4,11 21.4,0.2 12,0.2
  pour Top (isolate 0.2): 0.2,0.2 0.2,11 9.6,11 9.6,0.2
  pour Bottom (isolate 0.2): 0.2,0.2 0.2,11 9.6,11 9.6,0.2
  pour Bottom (isolate 0.2): 12,11 21.4,11 21.4,0.2 12,0.2
GPIO
  Top 0.203: IC4.25 30.89,28.19 32.54,26.54 33.34,26.54 33.97,25.9 35.08,25.9 35.88,25.11 Q4.3 Q5.3
HDMI_5V
  Top 0.254: HPWR.1 41.94,42.76 41.12,43.68 41.12,47.17 41.75,47.81 43.5,47.81 43.81,48.12 43.81,48.92 43.53,49.2 HDMI.18
HDMI_DECT
  Top 0.203: HDMI.19 39.93,48.7 39.84,48.61 R3.1
HSYNC  (via drill 0.3)
  Top 0.203: v4.76,49.87 4.8,49.91 LCD_BOT.9 | IC6.48 29.61,41.06 v30.08,40.58
  Bottom 0.203: v4.76,49.87 14.29,49.87 16.51,47.65 16.51,43.05 20.08,39.48 28.56,39.45 28.7,39.31 29.61,39.31 30.08,39.79 v30.08,40.58
HWB
  Top 0.203: IC4.33 34.88,28.64 35.8,27.72 38.09,27.72 38.09,27.71 R9.1
LED1
  Top 0.203: IC4.31 33.88,28.05 35.16,26.78 36.43,26.78 37.62,25.58 38.42,25.58 R20.1
LED2
  Top 0.203: IC4.32 34.38,28.19 35.32,27.25 36.59,27.25 37.55,26.29 38.98,26.29 39.53,25.74 R21.1
LED+  (via drill 0.4, 0.6)  (2 unrouted)
  Top 0.203: LCD_BOT.39 | 4.1,20.82 4.36,20.82 D2.C | L+.1 0.95,29.95 v1,30
  Top 0.254: LCD_BOT.39 5.2,34.91 5.08,34.79 | 2.22,20.82 C9.2
  Top 0.305: IC3.5 0.79,27.49
  Top 0.406: 0.79,29.87 0.79,34 1.59,34.79 5.08,34.79 | L+.1 0.79,29.87 | 0.79,29.87 0.79,27.49 0.79,21.3 1.27,20.82 2.22,20.82 | C9.2 2.22,20.82 4.1,20.82
  Top 0.5: D1.C 1.12,4.27 1,4.2 C27.2 1,10.2 v0.8,10.4 | U3.1 15.75,7.6 C29.2 v17,9
  Bottom 0.5: v17,9 15.4,7.4 13,7.4 12.4,8 12.4,10.2 v12.6,10.4
LED-  (via drill 0.4, 0.6)  (2 unrouted)
  Top 0.203: LCD_BOT.40 | 7.2,29.93 L-.1 | v9.2,30 9.3,30 J20_1.1
  Top 0.254: LCD_BOT.40 6.35,34.31
  Top 0.406: 7.14,30.03 7.14,30.19 6.35,30.98 6.35,34.31 | 7.14,30.03 J20_1.1 8.75,30.04 8.83,30.04 8.83,28.84 8.81,28.84 RS1.2 | IC3.3 7.14,28.51 L-.1 7.14,30.03
  Top 0.5: U2.3 7.75,8.15 9,9.4 v9,10.4 | U3.3 13.85,8.55 v14,8.77 RS5.1
  Bottom 0.6: v20.8,10.4 15.72,10.4 v14,8.77
LIGHT  (via drill 0.3)
  Top 0.203: IC4.40 36.33,32.75 37.15,31.93 v37.15,31.77 C16.2 R12.2
  Bottom 0.203: v37.15,31.77 36.67,31.77 35.56,30.66 35.56,24.39 29.97,18.8
  Bottom 0.254: 29.97,17.99 29.98,17.99 SV1.11
  Bottom 0.406: 29.97,18.8 29.97,17.99
LV_GPIO  (via drill 0.3)
  Top 0.203: v36.82,23.83 v36.83,23.84 Q4.2 | Q4.2 36.83,21.61 R19.1 | TP.5 9.8,17.44 v10.88,18.52 11.59,18.52 11.67,18.52 TP_INT.2 | 34.45,18.6 33.66,19.39 27.3,19.39 26.91,19.79 23.73,19.79 v23.5,20.03 | Q5.2 36.68,23.05 Q4.2
  Top 0.254: 35.07,17.98 SV1.7
  Top 0.406: 35.07,17.98 34.45,18.6
  Bottom 0.203: v36.82,23.83 35.08,22.09 35.08,18.76 | v23.5,20.03 22.7,20.03 21.35,18.68 11.04,18.68 v10.88,18.52
  Bottom 0.254: 35.08,17.99 SV1.7
  Bottom 0.406: 35.08,18.76 35.08,17.99
LV_RXD  (via drill 0.3)
  Top 0.203: R17.1 30.16,21.61 Q10.2 30.01,23.05 Q7.2 | R17.1 v30.63,21.46 | 30.01,21.38 R17.1 | v31.27,16.69 33.81,16.69 34.29,16.22
  Top 0.254: 30.01,21.38 R17.1
  Top 0.406: 34.29,16.22 SV1.8
  Bottom 0.203: v31.27,16.69 29.37,16.69 28.73,17.33 28.73,18.84 30.63,20.74 v30.63,21.46
LV_SCL  (via drill 0.3)
  Top 0.203: 36.97,18.61 36.44,19.15 34.85,19.15 34.13,19.87 27.54,19.87 27.14,20.26 24.45,20.26 23.73,20.98 v23.73,21.45 23.11,21.45 23.1,21.38 R16.1 | 11.65,16.24 TP_SCL.2 11.64,16.17 11.64,16.14 v10.79,16.14 | 10.78,16.24 v10.79,16.14 | TP.1 9.39,15.44 10.08,16.14 v10.79,16.14 | 23.1,21.46 23.1,21.47 23.1,22.88 Q9.2 23.34,23.05 Q6.2
  Top 0.254: 23.1,21.46 R16.1
  Top 0.406: 36.97,18.61 SV1.5
  Bottom 0.203: v23.73,21.45 22.86,21.45 20.88,19.47 10.4,19.47 9.84,18.91 9.84,16.93 10.64,16.14 v10.79,16.14
LV_SDA  (via drill 0.3)
  Top 0.203: 26.45,21.55 26.67,21.61 26.67,22.89 Q3.2 26.68,23.05 Q2.2 | 39.51,18.61 38.58,19.55 35.16,19.55 34.37,20.34 27.77,20.34 27.14,20.98 v27.14,21.3 26.53,21.3 | TP.2 9.17,15.94 10.56,17.33 v10.79,17.33 11.59,17.33 11.67,17.41 TP_SDA.2
  Top 0.254: 26.45,21.55 R15.1 26.52,21.38 26.53,21.3
  Top 0.406: 39.51,18.61 SV1.3
  Bottom 0.203: v27.14,21.3 26.28,21.3 23.89,18.91 22.85,18.91 21.19,17.25 10.87,17.25 v10.79,17.33
LV_TXD  (via drill 0.3)
  Top 0.203: 33.34,21.38 v34.05,21.38 | 33.34,21.54 33.5,21.69 Q11.2 33.34,23.05 Q8.2
  Top 0.254: R18.1 33.34,21.53 33.34,21.54 R18.1 | R18.1 33.34,21.38
  Bottom 0.203: v34.05,21.38 33.81,21.06 33.81,16.69 33.34,16.22
  Bottom 0.406: SV1.10 33.34,16.22
LX
  Top 0.203: 7.78,24.08 L1.2
  Top 0.254: D2.A 7.75,20.98 7.78,21.01 | 7.78,23.2 7.5,23.49 L1.2
  Top 0.406: IC3.1 7.46,26.54 7.46,24.95 7.78,24.63 7.78,24.08
  Top 0.635: 7.78,23.2 7.78,21.01
MISO
  Top 0.152: IC4.11 29.89,35.97 28.98,35.97 28.1,36.85 24.37,36.85 23.65,36.14 23.65,32.88 21.91,31.14
  Top 0.406: 21.91,31.14 ISP.MISO
MOSI
  Top 0.152: 19.37,32.41 20,31.77 21.75,31.77 23.26,33.28 23.26,36.3 24.21,37.25 28.26,37.25 29.05,36.46 30.16,36.46 30.39,36.23 IC4.10
  Top 0.406: ISP.MOSI 19.37,32.41
N$1
  Top 0.406: J20_2.2 11.66,28.75 RS3.2
N$3
  Top 0.203: U1.6 39.69,37.33 R11.1
N$4
  Top 0.406: J20_2.1 J20_1.2 10.42,28.78 RS2.2
N$5
  Top 0.152: U1.4
  Top 0.203: R10.1 39.69,39.23 U1.4
N$6
  Top 0.203: IC6.100 18.61,60.83 | R1.2 18.61,60.83 | 18.61,60.83 OCK-INV.1
N$7
  Top 0.203: IC6.3 15.48,55.19 14.61,56.06 14.61,57.37 OCK-INV1.2 14.61,57.49 R22.2
N$8
  Top 0.203: IC4.6 C10.2
N$9  (via drill 0.3)
  Top 0.203: R3.2 39.69,47.01 v38.89,47.01 | 42.1,41.46 HPWR.2 | 40.13,41.46 IPWR.1
  Top 0.406: 42.1,41.46 v41.12,41.46 40.13,41.46
  Bottom 0.203: v38.89,47.01 38.89,46.86 41.2,44.55 41.19,41.43 41.19,41.46 v41.12,41.46
N$10
  Top 0.2: RS4.2 4.1,9.6 | 4.1,9.6 RS6.2 | U2.4 4.1,9.6
N$11
  Top 0.406: PWR.2 42.07,31.3 41.59,30.82 F1.2
N$14
  Top 0.254: 6.6,6.2 6.7,6.2 U2.1
  Top 0.5: 6.2,4.2 5.6,4.2 6.2,4.8 | L3.2 6.2,4.2 | 6.2,4.2 6.2,4.8 | 6.2,4.8 6.2,5.6 | 6.2,5.6 6.2,6.25 U2.1 | 6.2,5.6 6.8,6.2 | 6.6,4.2 6.6,6.2
  Top 0.8: D1.A 5.6,4.2
N$16
  Top 0.5: U3.6 15.75,5 17.8,5 | L5.2 17.8,5 | 17.8,5 L4.1
N$17
  Top 0.203: R20.2 LED1.A
N$18
  Top 0.203: R21.2 LED2.A
PDO
  Top 0.203: 14.19,52.19 14.13,52.25 R2.1 | IC6.9 14.19,52.19 | R2.1 | R2.1 | LCD_BOT.10 7.16,49.41 7.62,49.87 10,49.87 12.32,52.19 14.19,52.19
PWM  (via drill 0.3, 0.4, 0.6)  (2 unrouted)
  Top 0.2: U2.5 3.4,7.2 2.8,7.8 v2.6,7.8 | U3.4 13.85,4.95 13.8,5 v13,5
  Top 0.203: 4.6,28.51 IC3.4 4.76,28.44 | IC4.29 32.88,27.83 v32.86,27.8
  Top 0.254: 4.6,28.51 4.6,28.44 3.81,28.44 | R7A.2 2.54,28.44 v3.49,28.44 3.81,28.44 | R7B.1 3.81,29.87 3.81,28.44
  Bottom 0.2: v2.6,7.8 2.8,7.6 7.2,7.6 v9,5.8 | v13,5 14.4,6.4 20.2,6.4 v20.8,5.8
  Bottom 0.203: 29.05,16.06 28.42,16.69 26.83,16.69 26.19,17.33 26.19,18.44 28.56,20.81 28.56,27.73 | v32.86,27.8 32.7,27.96 28.56,27.96 | 28.56,27.96 25.32,27.96 23.5,26.14 9.2,26.14 | 9.2,26.14 8.02,26.14 5.71,28.44 v3.49,28.44 | v9.2,25.4 9.2,26.14 | 28.56,27.73 28.56,27.96 | 28.56,27.73 28.73,27.89 | 28.56,27.73 28.4,27.89
  Bottom 0.406: 29.05,16.06 29.69,15.42 SV1.12
R0
  Top 0.203: IC6.30 20.61,41.27 20.32,40.98 12.06,40.98 9.37,38.28 9.37,36.54 8.73,35.9 8.18,35.9 7.67,36.41 LCD_BOT.36
R1  (via drill 0.3)
  Top 0.203: IC6.31 21.11,41.13 20.48,40.5 12.38,40.5 10,38.12 v10,35.98 | v4.76,36.85 4.82,36.91 LCD_BOT.35
  Bottom 0.203: v4.76,36.85 5.64,35.98 v10,35.98
R2  (via drill 0.3)
  Top 0.203: IC6.32 21.61,41 20.64,40.03 12.7,40.03 10.79,38.12 v10.79,36.61 | v8.41,36.7 7.7,37.41 LCD_BOT.34
  Bottom 0.203: v8.41,36.7 10.76,36.7 10.81,36.64 v10.79,36.61
R3  (via drill 0.3)
  Top 0.203: IC6.33 22.11,40.86 20.8,39.55 13.02,39.55 11.59,38.12 v11.59,37.33 | v4.76,37.97 4.82,37.91 LCD_BOT.33
  Bottom 0.203: v4.76,37.97 5.4,37.33 v11.59,37.33
R4  (via drill 0.3)
  Top 0.203: IC6.34 22.61,40.73 20.95,39.08 13.65,39.08 v12.54,37.97 | v8.57,37.97 8.13,38.41 LCD_BOT.32
  Bottom 0.203: v8.57,37.97 v12.54,37.97
R5  (via drill 0.3)
  Top 0.203: IC6.35 23.11,40.59 21.11,38.6 14.29,38.6 v13.65,37.97 | v4.76,38.92 4.77,38.91 LCD_BOT.31
  Bottom 0.203: v4.76,38.92 5.08,38.6 13.02,38.6 v13.65,37.97
R6  (via drill 0.3)
  Top 0.203: IC6.36 23.61,40.46 21.27,38.12 14.92,38.12 v14.76,37.97 | v7.94,39.23 7.77,39.41 LCD_BOT.30
  Bottom 0.203: v7.94,39.23 8.01,39.2 8.14,39.07 13.66,39.07 v14.76,37.97
R7  (via drill 0.3)
  Top 0.203: v4.76,40.03 4.88,39.91 LCD_BOT.29 | IC6.37 24.11,40.32 21.43,37.65 16.35,37.65 v16.19,37.49
  Bottom 0.203: v4.76,40.03 4.92,39.87 8.4,39.87 8.64,39.63 14.05,39.63 v16.19,37.49
RST  (via drill 0.3)
  Top 0.203: IC4.13 28.32,34.25 27.46,35.11 v27.46,35.74 R8.1
  Bottom 0.203: 22.54,35.9 27.3,35.9 v27.46,35.74
  Bottom 0.406: ISP.RST 21.59,35.9 22.54,35.9
RXD
  Top 0.203: IC4.20 28.34,30.75 27.62,30.03 27.62,26.85 29.21,25.27 Q10.3 Q7.3
SCDT
  Top 0.203: IC6.8 15.6,52.69 14.27,54.01 14.26,54 R2.2
SCK
  Top 0.152: 21.91,33.68 22.86,34.63 22.86,36.46 24.05,37.65 28.42,37.65 29.21,36.85 30.32,36.85 30.89,36.29 IC4.9
  Top 0.406: ISP.SCK 21.91,33.68
SCL  (via drill 0.3)
  Top 0.203: v31.04,33.92 31.04,33.04 29.74,31.75 IC4.18 28.07,31.75 26.67,30.34 26.67,27.01 26.04,26.38 23.65,26.38 22.54,25.27 Q9.3 Q6.3 | SCL.2 35.56,41.14 35.4,41.3 32.86,41.3 v32.07,40.5
  Bottom 0.203: v31.04,33.92 31.43,34.31 31.43,39.87 v32.07,40.5
SDA  (via drill 0.3)
  Top 0.203: v32.31,33.76 32.31,33.6 29.96,31.25 IC4.19 28.21,31.25 27.15,30.19 27.15,26.54 25.88,25.27 Q3.3 Q2.3 | SDA.2 37.78,40.82 37.15,40.19 34.13,40.19 v33.97,40.03
  Bottom 0.203: v32.31,33.76 32.54,34 32.54,38.6 v33.97,40.03
SHLD1
  Top 0.406: R13.2 49.05,32.09 49.69,32.73 49.69,33.84 | 49.69,33.84 49.69,40.51 X5.GND@2 49.71,40.68 X5.GND@1 | X5.GND@3 49.76,34.08 X5.GND@4 49.76,33.91 49.69,33.84
SHLD2
  Top 0.406: R14.2 49.05,30.34 49.69,29.71 49.69,28.6 | 49.69,28.6 49.69,22.14 X6.GND@3 49.6,21.95 X6.GND@4 | X6.GND@2 49.55,28.55 X6.GND@1 49.69,28.6
SHLD3
  Top 0.406: HDMI.SHLD2 47.95,43.37 47.31,42.73 R6.2
  Bottom 0.406: 46.83,45.74 43.05,45.74 HDMI.SHLD1 | 46.83,45.74 47.95,45.74 HDMI.SHLD2 | 46.83,45.74 46.83,60.19 | 46.83,60.19 47.95,60.19 HDMI.SHLD3 | 46.83,60.19 HDMI.SHLD4
SW1  (via drill 0.3)
  Top 0.203: SW1.1 SW1.4 22.09,19.23 22.09,19.1 22.07,19.07 22.12,19.06 22.12,18.99 26.35,18.99 26.75,18.6 | IC4.22 28.93,29.75 28.89,29.71 28.89,27.65 v29.62,26.93
  Top 0.254: 27.45,17.98 SV1.13
  Top 0.406: 27.45,17.98 27.41,17.98 27.41,17.99 26.75,18.6
  Bottom 0.203: v29.62,26.93 29.53,26.88 29.39,26.74 29.37,20.74 27.46,18.84
  Bottom 0.254: 27.46,17.99 SV1.13
  Bottom 0.406: 27.46,18.84 27.46,17.99
TXD
  Top 0.203: IC4.21 28.48,30.25 28.1,29.87 28.1,27.01 28.89,26.22 31.43,26.22 31.43,26.21 Q11.3 Q8.3
USBD_N
  Top 0.152: 45.01,37.01 45.01,37.02 | 46.53,36.7 46.68,36.71 46.9,36.71 X5.2
  Top 0.203: 46.53,36.7 45.32,36.7 arc-90 45.01,37.01 | 45.01,37.02 arc90 44.69,37.34 U1.1
USBD_P
  Top 0.152: 46.74,37.2 X5.3
  Top 0.203: 46.74,37.2 45.92,37.2 arc-90 45.48,37.65 45.48,38.6 arc90 44.85,39.23 U1.3
VBUS
  Top 0.406: X5.1 45.24,36.03 45.09,35.9 | U1.5 42.23,38.28 42.55,37.97 42.55,35.27 | 42.55,35.27 42.55,35.11 | 42.55,35.11 42.55,34.63 | 42.55,34.63 42.86,34.31 43.5,34.31 | 42.55,34.63 43.02,34.63 | 43.02,34.63 43.18,34.63 | 43.18,34.63 43.81,34.63 | 43.18,34.63 43.18,34.31 | 43.02,34.63 42.55,35.11 | C23.1 42.55,35.27
  Top 0.61: 45.09,35.9 43.81,34.63 43.5,34.31 PWR.3
VBUS_PWR
  Top 0.406: 44.61,23.99 44.7,23.9 X6.1
  Top 0.61: 44.61,23.99 43.5,25.11 PWR.1
VCCIO
  Top 0.203: 24.93,23.91 24.92,23.91 | 34.61,23.91 34.92,23.59 Q4.1 | Q11.1 31.59,23.83 31.59,23.91 | Q9.1 | Q10.1 28.26,23.91 | 35.08,21.14 35.88,20.34 40.32,20.34 42.05,18.61 | 21.5,21.47 21.51,21.61 21.51,22.89 Q9.1 | Q4.1 34.92,21.61 R19.2 | R17.2 28.26,21.61 Q10.1 | Q11.1 31.59,21.61 R18.2 | 21.59,23.91 | R15.2 25.08,21.46 24.92,21.61 Q3.1 25.08,23.05 Q2.1 | 21.5,21.46 R16.2 | Q6.1 21.74,23.05 Q9.1 | Q7.1 28.41,23.05 Q10.1 | Q8.1 31.74,23.05 Q11.1 | Q5.1 35.08,23.05 Q4.1
  Top 0.254: 24.92,23.91 28.26,23.91 31.59,23.91 34.61,23.91 | 21.59,23.91 24.93,23.91 Q3.1 | VCCIO.2 22.07,26.69 21.59,26.22 21.59,23.91 Q9.1 | 35.08,21.14 R19.2 | R17.2 | 21.5,21.47 21.5,21.46
  Top 0.406: 42.05,18.61 SV1.1
VSYNC  (via drill 0.3)
  Top 0.203: v7.94,50.59 7.75,50.41 LCD_BOT.8 | IC6.47 29.11,40.21 v29.29,40.03
  Bottom 0.203: v7.94,50.59 14.36,50.59 16.99,47.97 16.99,43.36 20.4,39.95 29.22,39.95 29.29,40.01 v29.29,40.03
X+  (via drill 0.3)
  Top 0.203: IC4.39 35.08,32.25 34.61,32.73 v34.29,32.73 | TP_BOT.4 12.31,62.01 13.49,60.83 13.49,54.95 10.55,52.01 v8.52,52.01 7.7,52.01 7.31,52.41 LCD_BOT.4 | v13.8,30.97 13.18,30.34 13.18,28.44 13.65,27.96 13.65,18.28 12.86,17.49 TP_SDA.1
  Bottom 0.203: v8.52,52.01 4.13,52.01 3.65,51.53 3.65,35.27 5.41,33.51 11.28,33.51 13.65,31.14 v13.8,30.97 13.97,30.82 15.8,28.99 22.54,28.99 25.24,31.69 33.1,31.69 34.14,32.73 v34.29,32.73
X-  (via drill 0.3)
  Top 0.203: IC4.37 34.96,31.25 34.61,30.9 v33.97,30.9 | TP_BOT.2 12.25,60.01 | 12.25,60.01 12.54,59.71 12.54,55.27 10.55,53.28 v8.02,53.28 7.89,53.41 LCD_BOT.2 | 12.25,60.01 v12.22,60.03 | R7.1 v13.18,62.89
  Bottom 0.203: v8.02,53.28 7.3,54 4.45,54 2.54,52.09 2.55,34.79 4.93,32.41 10.48,32.41 13.18,29.71 13.18,28.91 14.2,27.89 23.02,27.89 25.72,30.59 33.66,30.59 v33.97,30.9 | v12.22,60.03 13.18,60.98 v13.18,62.89
XTAL1
  Top 0.203: IC4.17 27.78,32.25 26.11,30.57 Q1.2
XTAL2
  Top 0.203: IC4.16 27.12,32.75 26.9,32.97 Q1.1
Y+  (via drill 0.3)
  Top 0.203: v1.91,53.36 2.45,53.91 LCD_BOT.1 6.38,53.91 6.39,53.92 10.55,53.92 12.06,55.43 12.06,58.6 11.66,59.01 TP_BOT.1 | IC4.36 35.09,30.75 v34.45,30.11 | v12.94,27.41 13.18,27.17 13.18,19.23 12.77,18.83 TP_INT.1
  Bottom 0.203: v1.91,53.36 1.98,53.28 2,34.55 4.7,31.86 10.25,31.86 12.55,29.56 12.55,27.8 v12.94,27.41 13.08,27.26 23.18,27.26 26.04,30.12 34.47,30.12 v34.45,30.11
Y-  (via drill 0.3)
  Top 0.203: IC4.38 34.63,31.75 v34.53,31.85 | v4.76,53.05 4.9,52.91 LCD_BOT.3 7.44,52.91 7.7,52.65 10.55,52.65 13.02,55.11 13.02,60.35 12.36,61.01 TP_BOT.3 | v13.97,29.39 14.13,29.23 14.13,17.49 12.86,16.22 TP_SCL.1
  Bottom 0.203: v4.76,53.05 4.29,53.05 3.1,51.86 3.1,35.03 5.17,32.96 10.72,32.96 13.97,29.71 v13.97,29.39 14.92,28.44 22.78,28.44 25.48,31.14 33.26,31.14 33.97,31.85 v34.53,31.85

## Text on the board
tPlace: o | EDID | Data | GND | 5V | +20 | +20 | 3V3 | 5V | 1 | 2 | Power | 1 | 16